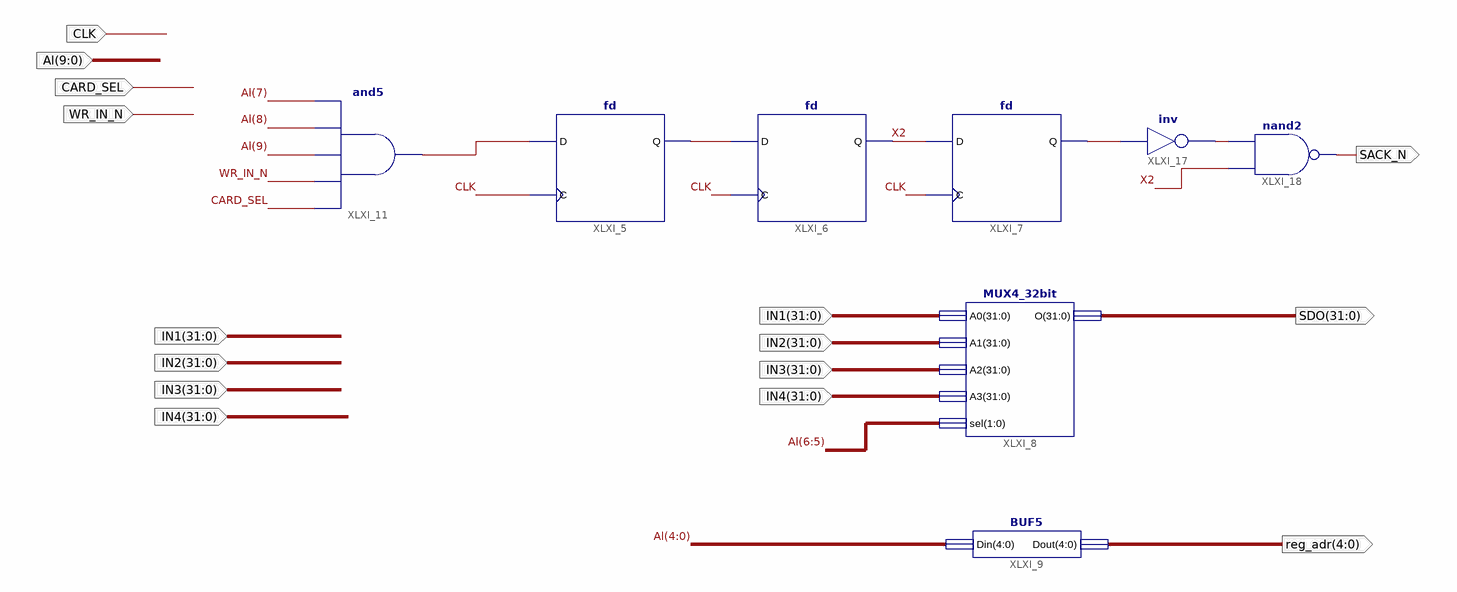
[diagram p0: schematic sheet 1]
// Xilinx ISE schematic Slave.sch (spartan6) as structural Verilog: 8 symbols, 11 ports
module Slave (
  input  CLK,
  input  CARD_SEL,
  input  WR_IN_N,
  input  [9:0] Al,
  input  [31:0] IN1,
  input  [31:0] IN2,
  input  [31:0] IN4,
  input  [31:0] IN3,
  output [31:0] SDO,
  output SACK_N,
  output [4:0] reg_adr
);

  wire X2, XLXN_27, XLXN_28, XLXN_34, XLXN_51;

  MUX4_32bit XLXI_8 (.A0(IN1), .A1(IN2), .A2(IN3), .A3(IN4), .sel(Al[6:5]), .O(SDO));
  BUF5 XLXI_9 (.Din(Al[4:0]), .Dout(reg_adr));
  fd XLXI_5 (.C(CLK), .D(XLXN_27), .Q(XLXN_28));
  fd XLXI_6 (.C(CLK), .D(XLXN_28), .Q(X2));
  fd XLXI_7 (.C(CLK), .D(X2), .Q(XLXN_34));
  and XLXI_11 (XLXN_27, CARD_SEL, WR_IN_N, Al[9], Al[8], Al[7]);
  not XLXI_17 (XLXN_51, XLXN_34);
  nand XLXI_18 (SACK_N, X2, XLXN_51);
endmodule
